# Altium schematic sheet Schematic_Sheet_1.SchDoc
size A4; SheetNumber: 1; SheetTotal: 1
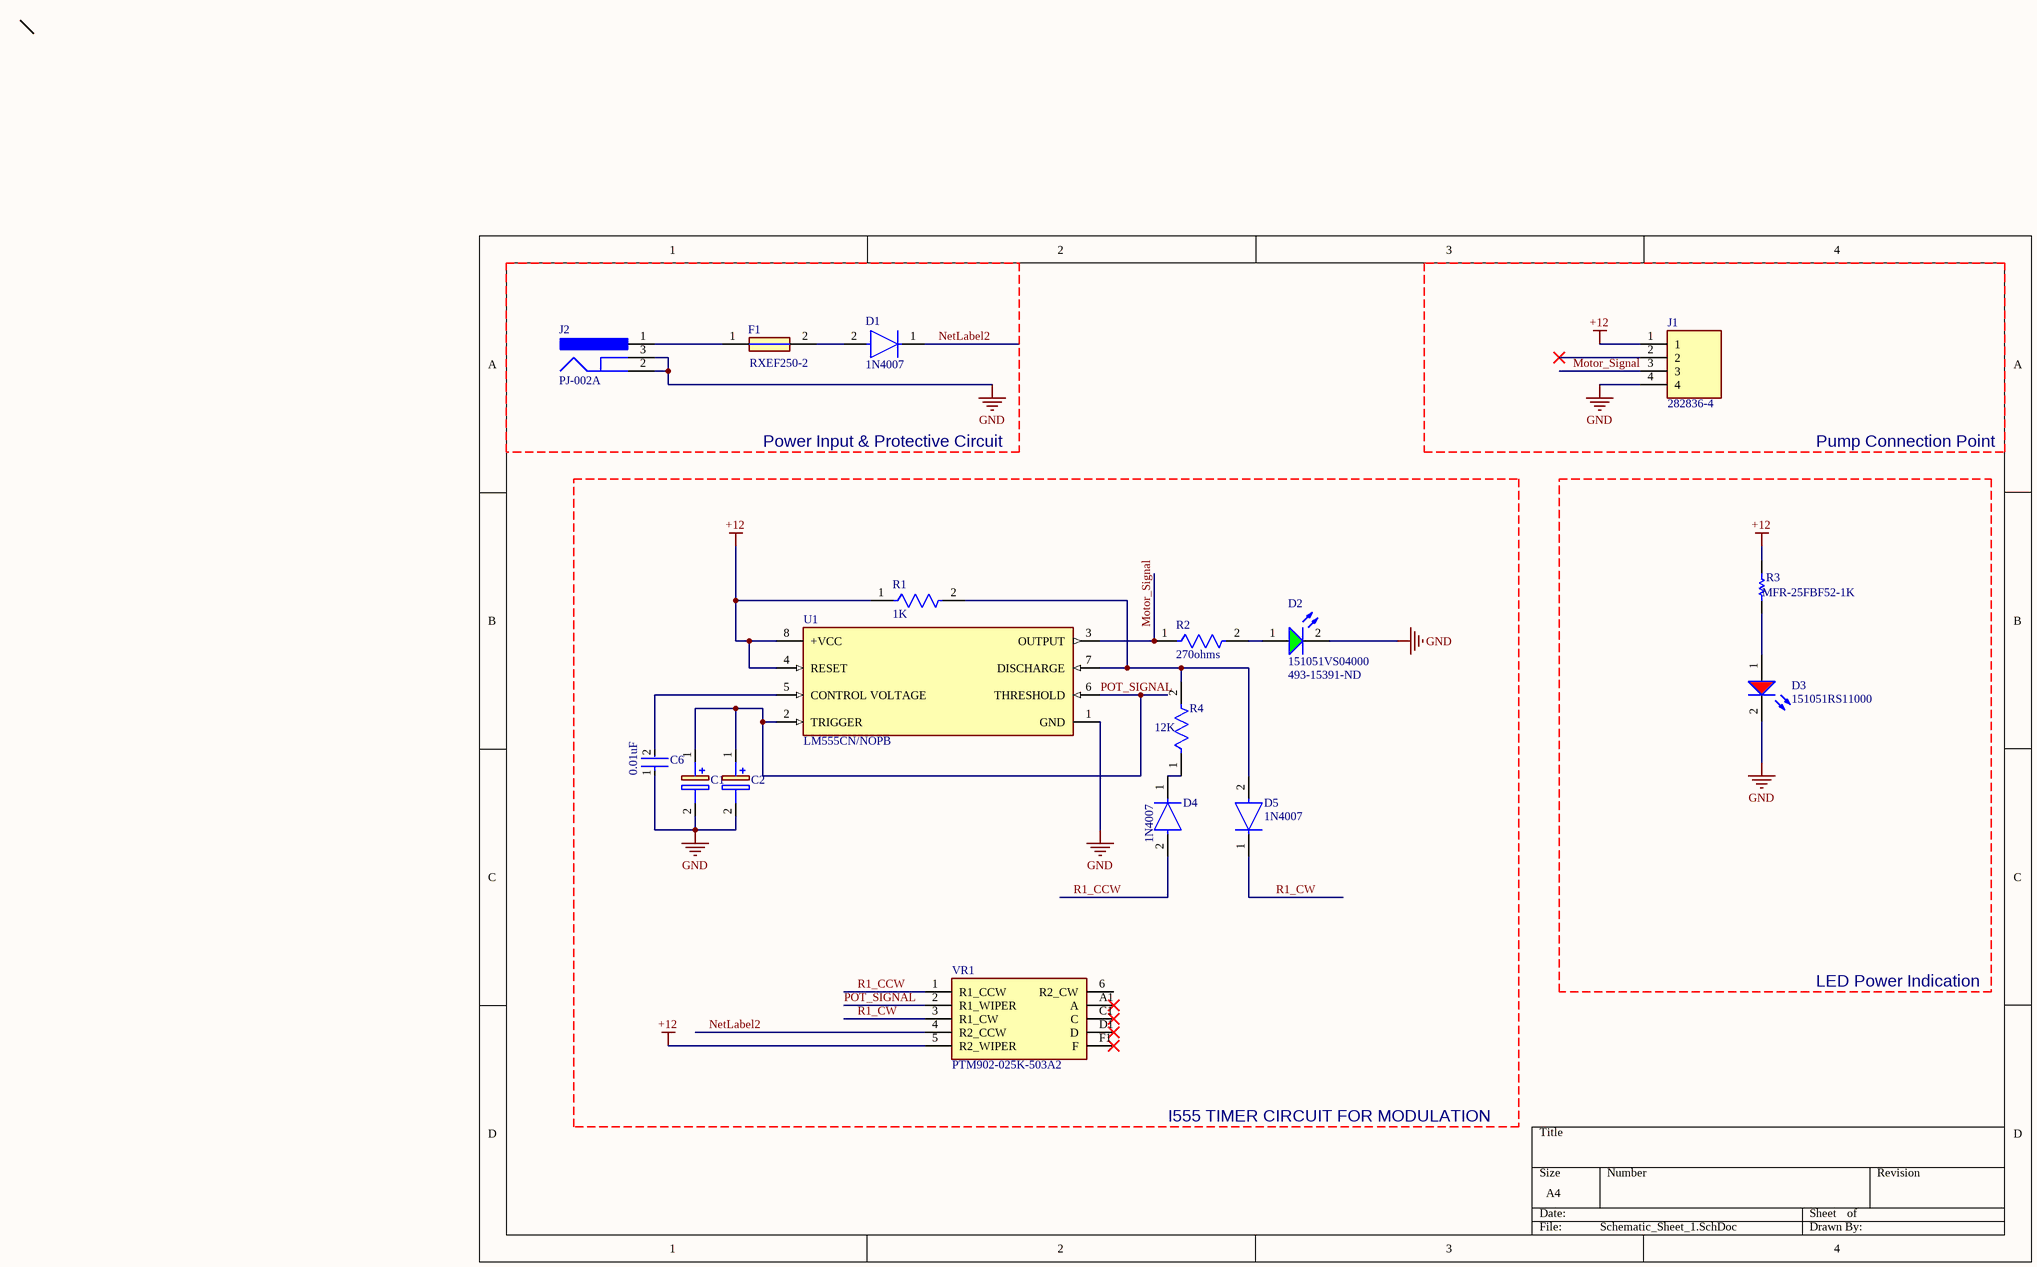
[diagram p0: Schematic_Sheet_1.SchDoc]

## Parts
C1  ESH106M050AC3AA  [ESH106M050AC3AA]  (value not drawn)
C2  ESH106M050AC3AA  [ESH106M050AC3AA]  (value not drawn)
C6  0.01uF  [FP-C410C104M5U5TA7200-MFG]
D1  1N4007  [FP-1N4007-MFG]
D2  151051VS04000  Supplier Part Number 1: 493-15391-ND  [WL-TMRC_D5.9H8.7]
D3  151051RS11000  [WL-TMRC_D5.9H8.7]
D4  1N4007  [FP-1N4007-MFG]
D5  1N4007  [FP-1N4007-MFG]
F1  RXEF250-2  [RXEF2502]
J1  282836-4  [2828364]
J2  PJ-002A  [CUI-PJ-002A_V]
R1  1K  [FP-MRS1600-MFG]
R2  270ohms  [FP-MRS1600-MFG]
R3  MFR-25FBF52-1K  [RESA60-630X240]
R4  12K  [FP-MRS1600-MFG]
U1  LM555CN/NOPB  [FP-P0008A-MFG]
VR1  PTM902-025K-503A2  [PTM902025K503A2]

## Nets
+12: J1.1 R1.1 R3.1 U1.4(RESET) U1.8(+VCC) VR1.5(R2_WIPER)
GND: C1.2(-) C2.2(-) C6.1 D2.2(K) D3.2(K) J1.4 J2.2 J2.3 U1.1(GND)
Motor_Signal: J1.3 R2.1 U1.3(OUTPUT)
NetLabel2: D1.1(C) VR1.4(R2_CCW)
POT_SIGNAL: C1.1(+) C2.1(+) U1.2(TRIGGER) U1.6(THRESHOLD) VR1.2(R1_WIPER)
R1_CCW: D4.2(A) VR1.1(R1_CCW)
R1_CW: D5.1(C) VR1.3(R1_CW)
NetC6_2: C6.2 U1.5(CONTROL_VOLTAGE)
NetD1_2: D1.2(A) F1.2
NetD2_1: D2.1(A) R2.2
NetD3_1: D3.1(A) R3.2
NetD4_1: D4.1(C) R4.1
NetD5_2: D5.2(A) R1.2 R4.2 U1.7(DISCHARGE)
NetF1_1: F1.1 J2.1

Not connected (* = marked no-connect by the designer): J1 2*; VR1 6(R2_CW) A1(A)* C1(C)* D1(D)* F1(F)*

## Notes on the sheet
- Power Input & Protective Circuit
- Pump Connection Point
- LED Power Indication
- I555 TIMER CIRCUIT FOR MODULATION

## Library data of the parts
C1 C2 = ESH106M050AC3AA: Aluminium Electrolytic Capacitors - Radial Leaded 50V 10uF 105C 2k Hour Radial; Manufacturer_Name: KEMET; Datasheet Link: https://content.kemet.com/datasheets/KEM_A4005_ESH.pdf; Height: 12.5mm; Manufacturer_Part_Number: ESH106M050AC3AA; Mouser Part Number: 80-ESH106M050AC3AA; Mouser Price/Stock: https://www.mouser.co.uk/ProductDetail/KEMET/ESH106M050AC3AA?qs=w9hhVRgtvfk%252BayNmSQobGw%3D%3D; Arrow Part Number: ESH106M050AC3AA; Arrow Price/Stock: https://www.arrow.com/en/products/esh106m050ac3aa/kemet-corporation?utm_currency=USD&region=nac
C6 = CMP-03020-034640-1: CAP CER 0.1UF 50V Z5U AXIAL; Capacitance: 100nF; Tolerance: 20%; Lead Diameter: 0.51mm; Dissipation Factor: 4%; Lead Length: 25.4mm; Mount: Through Hole; Length: 4.32mm; Lead Free: Lead Free; Number of Pins: 2; Case/Package: Axial; Max Operating Temperature: 85°C; RoHS Compliant: Yes; Dielectric: Z5U; Min Operating Temperature: 10°C; Series: Aximax 400; Termination: Axial; Radiation Hardening: No; Voltage Rating (DC): 50V; REACH SVHC: No SVHC; Construction: AXIAL; Package Quantity: 5000; Packaging: Tape and Reel; Voltage Rating: 50V
D1 D4 D5 = CMP-123542-000001-1: Rectifier diode 1000 V 1 A DO-41, ,; Manufacturer: Diotec; Max Surge Forward Current: 27A; Forward Current: 1A; Max Junction Temp: +175°C; Reverse Voltage: 1000V; Value: 15pF; Peak Reverse Current: 5uA; Category: Diode; Temperature Range Low: -50°C; Automotive: No; Temperature: -50°C to +175°C; Lead Free: Yes; ComponentLink2Description: Datasheet; Max Repetitive Reverse Voltage: 1000V; ComponentLink2URL: https://datasheet.octopart.com/1N4007-Diotec-datasheet-62346875.pdf; Manufacturer Part Number: 1N4007; Device Class L3: Rectifier Diodes; Height: 2.8mm; Octopart: https://octopart.com/1n4007-diotec-4040411; Package: 1N4007; Temperature Range High: +175°C; Device Class L1: Discrete Semiconductors; Device Class L2: Diodes; RoHS: TRUE; Capacitance: 15pF; Ipc Land Pattern Name: DIOAD888W100L520D280
D2 = CMP-1488-00007-2: NexarPartId: 29717814; Manufacturer: Nichicon; Manufacturer Part Number: UKL1HR15KDDANA; Forward Voltage: 2.1V; Viewing Angle: 40°; Lens Size: 5mm; Luminous Intensity: 140mcd; Color: Green; Max Reverse Voltage (DC): 5V; Wavelength: 572nm; Forward Current: 100mA; Peak Wavelength: 573nm; Test Current: 20mA; Lens Style: Circular, Diffused, Round; Value: 150nF; Tolerance: 10%; Voltage Rating: 50V; Ripple Current: 1.6mA; Life (Hours): 2000Hour; REACH SVHC: Unknown; Height: 8.6mm; Mount: Through Hole; Width: 5mm; Length: 5mm; Min Operating Temperature: -40°C; RoHS: Compliant; Dominant Wavelength: 572nm; Case/Package: Radial; Max Operating Temperature: 85°C; Packaging: Bulk; Supplier 1: Digikey; Category: Aluminum Electrolytic Capacitors; Stock 1: 3618; Pricing 1: 1=0.29, 10=0.188, 50=0.1386, 100=0.1129, 500=0.08914, 2000=0.07131, 4000=0.06975 (USD); Mounting Technology: Through Hole; Package Quantity: 200; Series: UKL; Termination: Radial; Diameter: 5mm; Lead Pitch: 0.079inch; Height - Seated (Max): 0.472inch; Radiation Hardening: No; RoHS Compliant: Yes; ComponentLink1URL: https://datasheet.ciiva.com/11688/e-kl-11688681.pdf?src-supplier=Avnet; ComponentLink1Description: https://datasheet.ciiva.com/11688/e-kl-11688681.pdf?src-supplier=Avnet; ComponentLink2URL: https://datasheet.ciiva.com/109/e-kl-109678.pdf?src-supplier=Digikey; ComponentLink2Description: https://datasheet.ciiva.com/109/e-kl-109678.pdf?src-supplier=Digikey
D3 = CMP-1488-00008-2: NexarPartId: 29717813; Lens Style: Circular, Diffused, Round; Lens Size: 5mm; Forward Voltage: 2.1V; Peak Wavelength: 650nm; Forward Current: 100mA; Viewing Angle: 60°; Color: Red; Wavelength: 630nm; Test Current: 20mA; Dominant Wavelength: 645nm; Luminous Intensity: 30mcd; Max Reverse Voltage (DC): 5V; Height: 8.6mm; Length: 5mm; Min Operating Temperature: -40°C; Max Operating Temperature: 85°C; Packaging: Bulk; REACH SVHC: Unknown; Case/Package: Radial; RoHS: Compliant; Width: 5mm; Mount: Through Hole
F1 = RXEF250-2: Fuse; Manufacturer_Name: LITTELFUSE; Datasheet Link: https://www.littelfuse.com/~/media/electronics/datasheets/resettable_ptcs/littelfuse_ptc_radial_leaded_rxef_datasheet.pdf.pdf; Height: 25.4mm; Manufacturer_Part_Number: RXEF250-2; Mouser Part Number: 650-RXEF250-2; Mouser Price/Stock: https://www.mouser.co.uk/ProductDetail/Littelfuse/RXEF250-2?qs=k5V78Jg%2Feq5GsZ7NS1UD7A%3D%3D; Arrow Part Number: RXEF250-2; Arrow Price/Stock: https://www.arrow.com/en/products/rxef250-2/littelfuse?region=nac
J1 = 282836-4: Connector; Manufacturer_Name: TE Connectivity; Datasheet Link: https://www.te.com/commerce/DocumentDelivery/DDEController?Action=srchrtrv&DocNm=1-1773458-1_EURO_STYLE_QRG&DocType=Data%20Sheet&DocLang=English&PartCntxt=282836-4&DocFormat=pdf; Height: 10.2mm; Manufacturer_Part_Number: 282836-4; Mouser Part Number: 571-2828364; Mouser Price/Stock: https://www.mouser.co.uk/ProductDetail/TE-Connectivity/282836-4?qs=A%252Bip%252BNCYi6ObENxJffNuog%3D%3D; Arrow Part Number: 282836-4; Arrow Price/Stock: https://www.arrow.com/en/products/282836-4/te-connectivity?region=europe
J2 = CMP-2000-06895-2: Through Hole Right Angle DC Power Jack, 2.5 A, 2 mm Center Pin, 3 Position, -25 to 85 degC, RoHS, Bulk; Manufacturer: CUIInc.; Brand: CUI; Inside Contact Diameter: 2mm; Voltage Rating: 24V; Outside Contact Diameter: 6.5mm; Current Rating: 2.5A; Insulation Resistance: 50MOhms; Contact Gender: Male; Connector Type: DCPowerJack; Datasheet Version: Rev. 1.03, 04/2016; Housing Material: PolybutyleneTerephthalate(PBT); Operating Temperature Range: -25Cto+85C; Termination Style: ThroughHole; Product Category: DCPowerConnectors; Mounting Technology: ThroughHole; Mounting Style: ThroughHole; Factory Pack Quantity: 500; Contact Plating: Nickel; Package Reference: PJ-002A; Mounting Angle: Right; Package Description: 3-Pin Through Hole Device, Body 14.4 x 9 mm, Height 11 mm; Flammability Rating: UL94V-0; Manufacturer URL: http://www.cui.com/; Product: Jacks; Contact Material: Copper; Datasheet URL: http://www.cui.com/product/resource/pj-002a.pdf; RoHS: True
R1 R2 R4 = CMP-02408-000019-1: RES 20K OHM 0.4W 1% AXIAL; Max Power Dissipation: 400mW; Temperature Coefficient: 50ppm/°C; Resistance: 20kR; Technology: THIN FILM; Max Operating Temperature: 155°C; Number of Terminations: 2; RoHS Compliant: Yes; Packaging: Tape and Reel; Radiation Hardening: No; Contact Plating: Tin; Military Standard: Not; Construction: Cylindrical; Diameter: 1.6mm; Tolerance: 1%; Mount: Through Hole; Power Rating: 400mW; Case/Package: Conformal; Termination: Axial; Length: 3.6mm; Min Operating Temperature: -55°C; Resistor Type: Metal Film; Series: MRS16
R3 = CMP-1659-00075-1: Axial Resistor, 1 KOhm, +/- 1%, 0.25W, -55 to 155 degC, 2-Pin THD, RoHS, Bulk; Voltage Rating: 250 V; Resistance: 10 kohm; Power Rating: 250 mW; ComponentLink2Description: Datasheet; RoHSCompliant: true; PackageReference: MFR-25; Case\Package: Axial; Max Operating Temperature: 155 degC; DatasheetVersion: Apr-13; Tolerance: 1%; ComponentLink1URL: http://www.yageo.com/; Length: 0.248 inch; ComponentLink2URL: http://www.yageo.com/documents/recent/Yageo%20LR_MFR_2013.pdf; Packaging: Bulk; Package Quantity: 200; PackageDescription: 2-Pin Axial Lead, Dia 2.4 mm, Body Length 6.3 mm; Min Operating Temperature: -55 degC; ComponentLink1Description: Manufacturer URL
U1 = CMP-0056-00016-4: IC OSC SINGLE TIMER 100KHZ 8-DIP; Manufacturer: Texas Instruments; Min Supply Voltage: 4.5V; Standoff Height: 0.51mm; Number Of Timers/Counters: 1; Max Supply Voltage: 16V; Max Junction Temp: +70°C; Nominal Supply Current: 3mA; ComponentLink2Description: Datasheet; Category: IC; Manufacturer Part Number: LM555CN/NOPB; Digikey Description: IC OSC SINGLE TIMER 100KHZ 8-DIP; Ambient Temperature Range High: +70°C; Automotive: No; Device Class L3: Timers and Oscillators; Device Class L1: Integrated Circuits (ICs); Temperature Range High: +70°C; Lead Free: Yes; ComponentLink2URL: http://www.ti.com/lit/ds/symlink/lm555.pdf; Octopart: https://octopart.com/lm555cn%2Fnopb-texas+instruments-24814897; RoHS: TRUE; Ambient Temperature Range Low: 0°C; Temperature Range Low: 0°C; Package: P0008A; Temperature: 0°C to +70°C; Height: 5.08mm; Device Class L2: Clock and Timing
VR1 = PTM902-025K-503A2: Variable Resistor; Manufacturer_Name: Bourns; Datasheet Link: https://www.mouser.com/datasheet/2/54/PTM90-777949.pdf; Height: 11.35mm; Manufacturer_Part_Number: PTM902-025K-503A2; Mouser Part Number: 652-PTM902-025K503A2; Mouser Price/Stock: https://www.mouser.co.uk/ProductDetail/Bourns/PTM902-025K-503A2?qs=U%2FacTlguYxY%252BH47tVYAt6w%3D%3D